# Altium project E2_TP1.PrjPcb
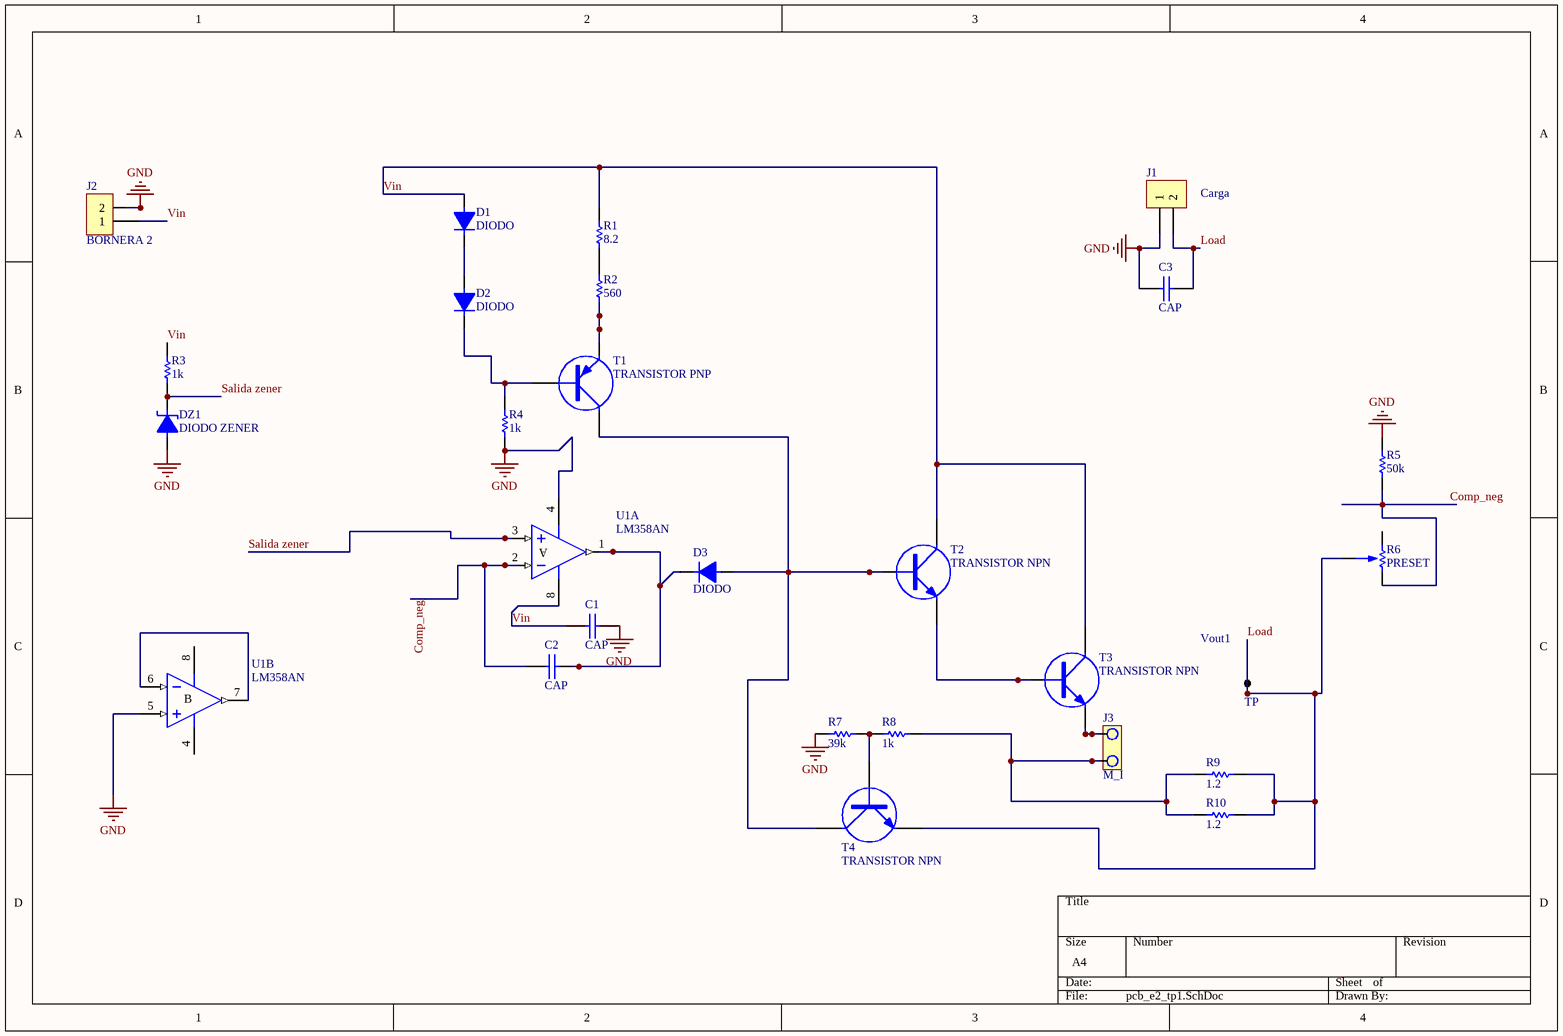
[diagram p0: pcb_e2_tp1.SchDoc]
1 sheet, 26 parts. Net scope: global (net labels, ports and power ports of the same name join across sheets).
Board file: pcb_e2_tp1.PcbDoc

## Sheet pcb_e2_tp1.SchDoc
size A4

### Parts
C1  CAP  [CAP200]
C2  CAP  [CAP200]
C3  CAP  [CAP200]
D1  DIODO  [DO41]
D2  DIODO  [DO41]
D3  DIODO  [DO41]
DZ1  DIODO ZENER  [DO41]
J1  Carga  [BORNERA2]
J2  BORNERA 2  [BORNERA2]
J3  M_I  [JUMPER2]
R1  8.2  [RES400]
R2  560  [RES400]
R3  1k  [RES400]
R4  1k  [RES400]
R5  50k  [RES400]
R6  PRESET  [PRESET V]
R7  39k  [RES400]
R8  1k  [RES400]
R9  1.2  [RES1200]
R10  1.2  [RES1200]
T1  TRANSISTOR PNP  [TO92]
T2  TRANSISTOR NPN  [TO92]
T3  TRANSISTOR NPN  [TO-220 V]
T4  TRANSISTOR NPN  [TO92]
U1  LM358AN  [DIP8]  (parts A,B of 2)
Vout1  TP  [TPTH]

### Nets
GND: C1.2 C3.1 DZ1.1 J1.1 J2.2 R4.1 R5.2 R7.1 U1.4(V-) U1.5(IN+)
Comp_neg: C2.1 R5.1 R6.1 U1.2(IN-)
Load: C3.2 J1.2 R6.2 R9.2 R10.2 T4.3(E) Vout1.1
Salida zener: DZ1.2 R3.1 U1.3(IN+)
Vin: C1.1 D1.1 J2.1 R1.2 R3.2 T2.2(C) T3.2(C) U1.8(V+)
NetC2_2: C2.2 D3.2 U1.1(OUT)
NetD1_2: D1.2 D2.1
NetD2_2: D2.2 R4.2 T1.1(B)
NetD3_1: D3.1 T1.2(C) T2.1(B) T4.2(C)
NetJ3_1: J3.1 R8.2 R9.1 R10.1
NetJ3_2: J3.2 T3.3(E)
NetR1_1: R1.1 R2.2
NetR2_1: R2.1 T1.3(E)
NetR7_2: R7.2 R8.1 T4.1(B)
NetT2_3: T2.3(E) T3.1(B)
NetU1_6: U1.6(IN-) U1.7(OUT)

Not connected (* = marked no-connect by the designer): R6 3

### Notes on the sheet
- (in symbol LM358AN, part A) A
- (in symbol LM358AN, part B) B

### Library data of the parts
J1 = BORNERA 2
J3 = JUMPER
R1-R5 R7-R10 = RES
U1 = LM358AN: Low-Power Dual Operational Amplifier; Published: 24-Aug-2001; LatestRevisionDate: 06-Jun-2005; LatestRevisionNote: Stylized 3D Model Added.; DatasheetVersion: Jun-1998; PackageReference: DIP8; Publisher: Altium Limited; PackageDescription: DIP; 8 Leads; Row Spacing 7.62 mm; Pitch 2.54 mm; Code_JEDEC: MO-001-AN; ComponentLink1Description: Manufacturer Link; ComponentLink1URL: http://www.st.com/; ComponentLink2Description: Datasheet; ComponentLink2URL: http://www.st.com/stonline/products/literature/ds/2163/lm358.pdf